# EasyEDA schematic SCH_Wordy-Watch-V1.1_2026-04-09.json
TITLE: Wordy Watch; REV: 1.1; Date: 2025-10-31; Sheet: 1/1; Drawn By: robdobsn; Company: Rob Dobson
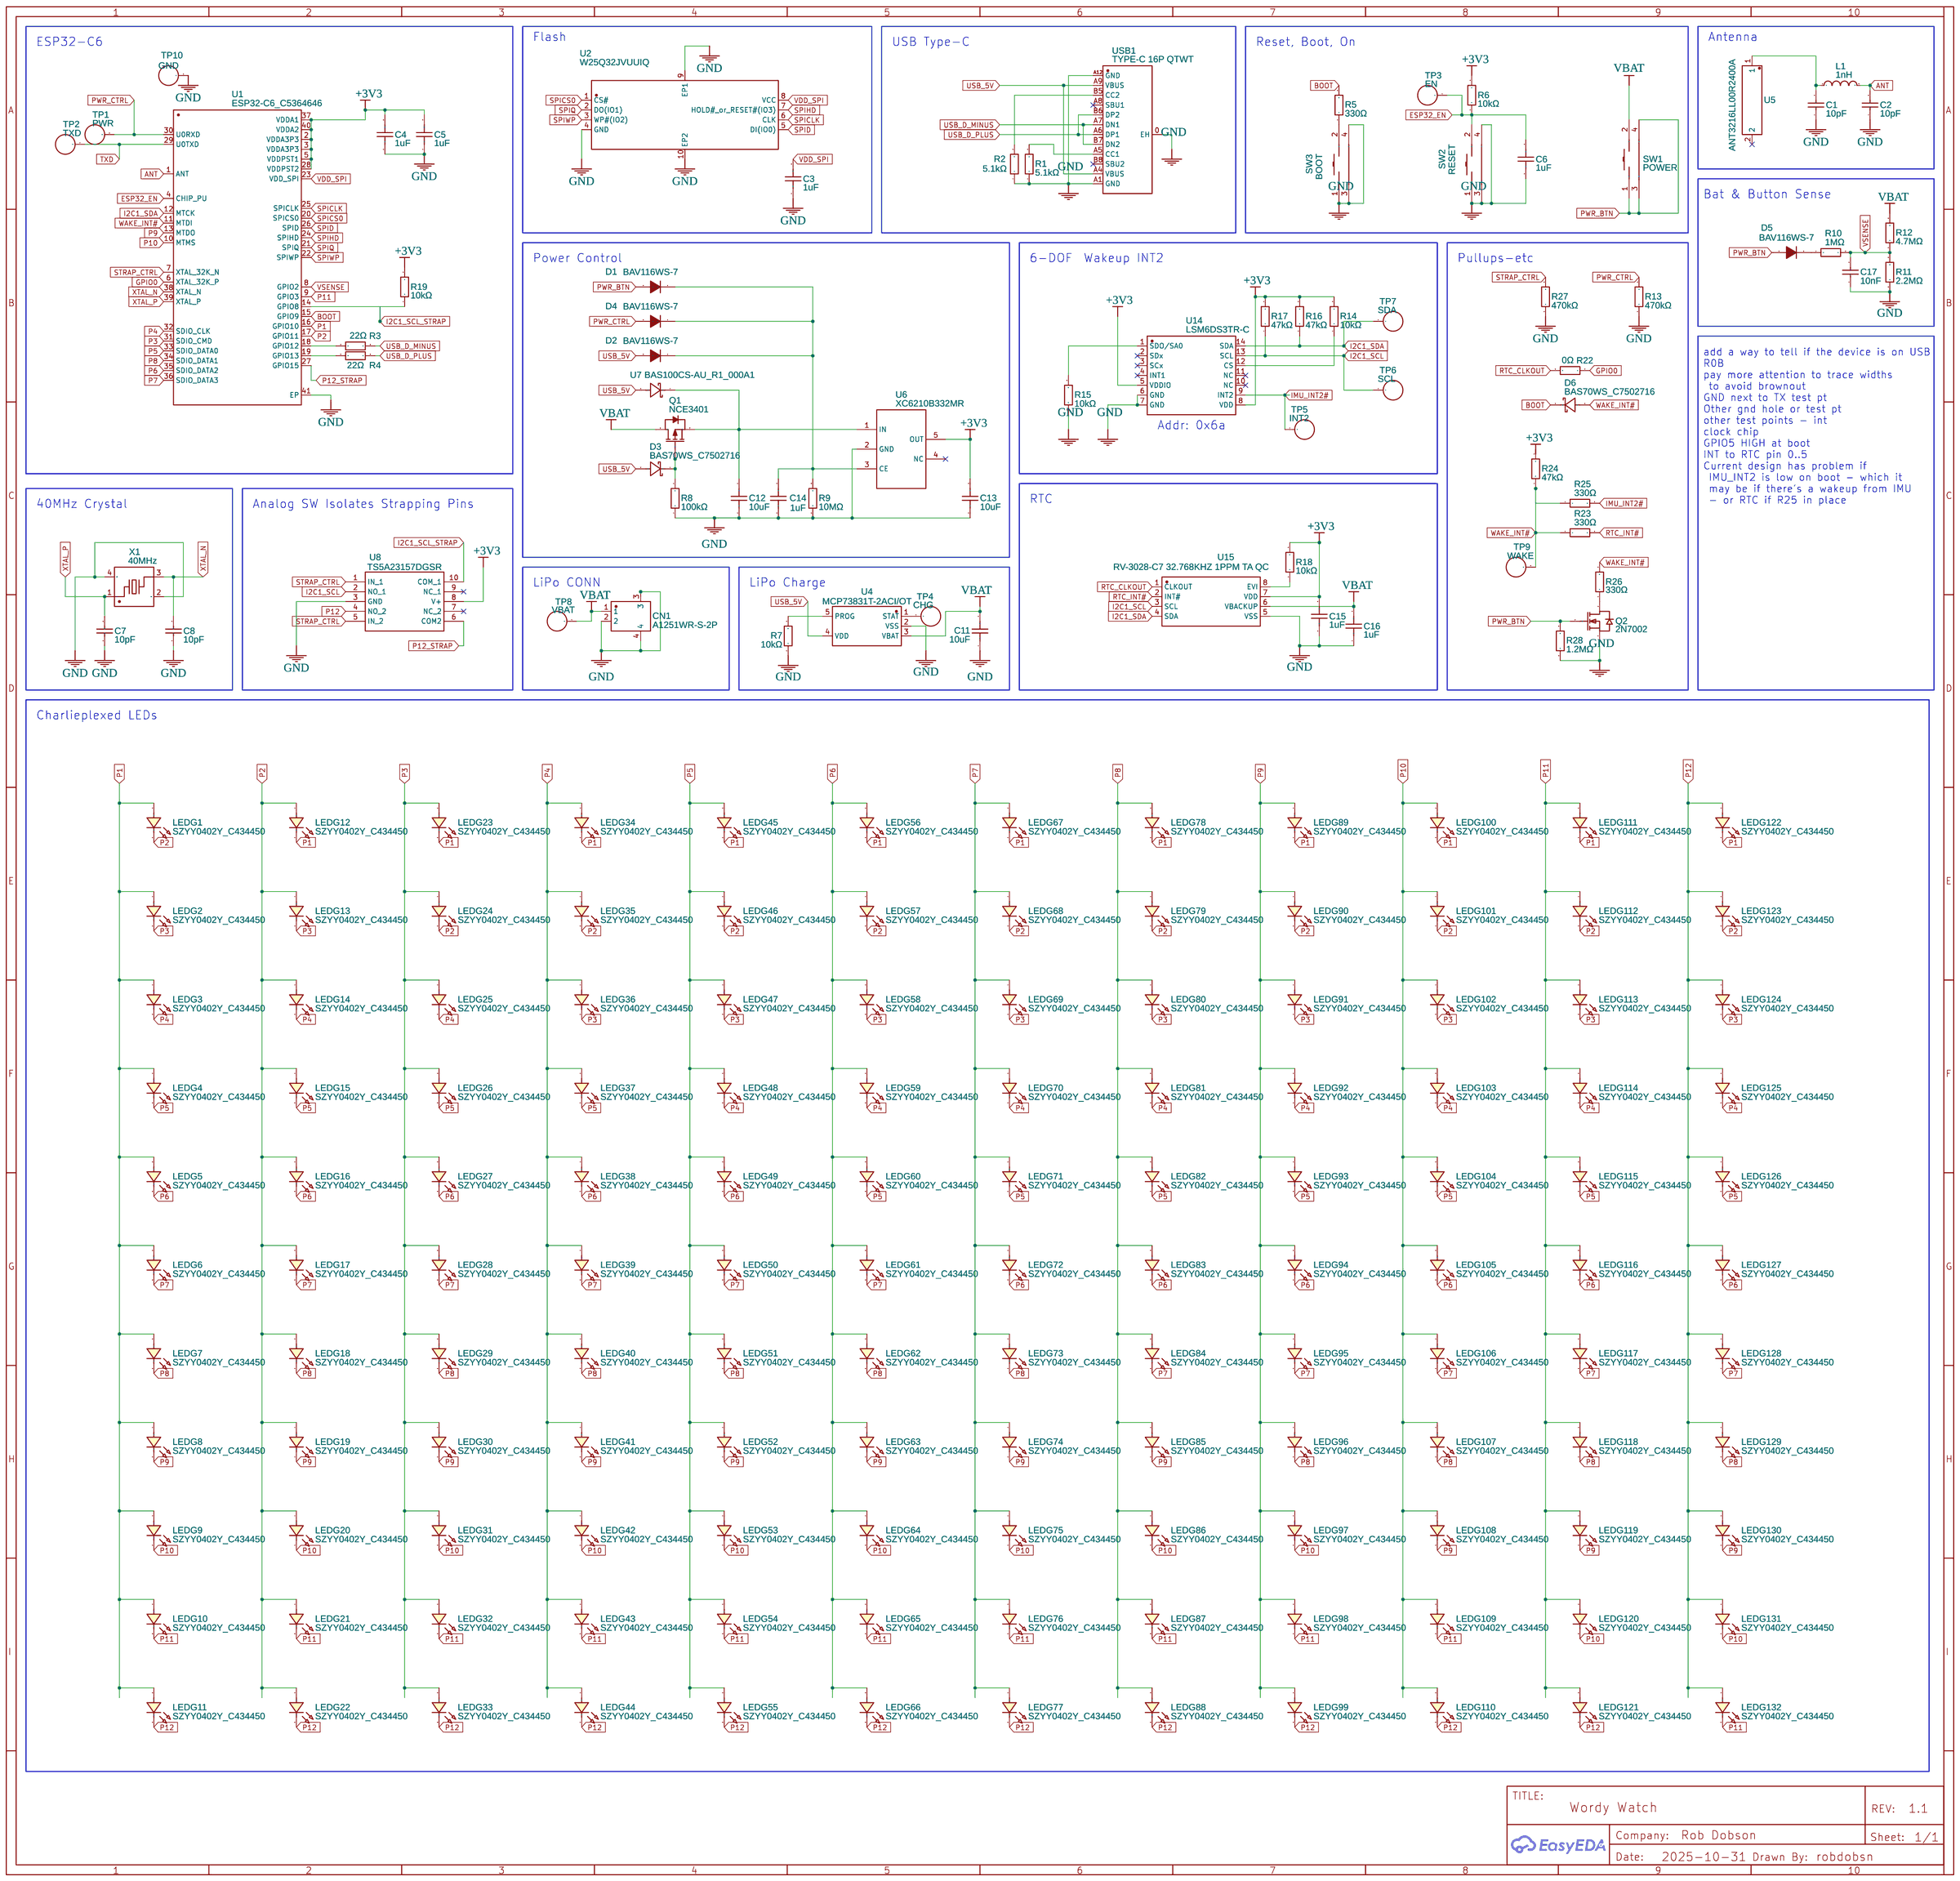
[diagram p0: schematic sheet]

## Parts
C1  10pF  [C0603]
C2  10pF  [C0603]
C3  1uF  [C0603]
C4  1uF  [C0603]
C5  1uF  [C0603]
C6  1uF  [C0603]
C7  10pF  [C0603]
C8  10pF  [C0603]
C11  10uF  [C0603]
C12  10uF  [C0603]
C13  10uF  [C0603]
C14  1uF  [C0603]
C15  1uF  [C0603]
C16  1uF  [C0603]
C17  10nF  [C0603]
CN1  A1251WR-S-2P  [CONN-SMD_A1251WR-S-2P]
D1  BAV116WS-7  [SOD-323_L1.8-W1.3-LS2.5-RD]
D2  BAV116WS-7  [SOD-323_L1.8-W1.3-LS2.5-RD]
D3  BAS70WS_C7502716  [SOD-323_L1.7-W1.3-LS2.6-RD-1]
D4  BAV116WS-7  [SOD-323_L1.8-W1.3-LS2.5-RD]
D5  BAV116WS-7  [SOD-323_L1.8-W1.3-LS2.5-RD]
D6  BAS70WS_C7502716  [SOD-323_L1.7-W1.3-LS2.6-RD-1]
L1  1nH  [L0402]
LEDG1  SZYY0402Y_C434450  [LED0402-FD_YELLOW]
LEDG2  SZYY0402Y_C434450  [LED0402-FD_YELLOW]
LEDG3  SZYY0402Y_C434450  [LED0402-FD_YELLOW]
LEDG4  SZYY0402Y_C434450  [LED0402-FD_YELLOW]
LEDG5  SZYY0402Y_C434450  [LED0402-FD_YELLOW]
LEDG6  SZYY0402Y_C434450  [LED0402-FD_YELLOW]
LEDG7  SZYY0402Y_C434450  [LED0402-FD_YELLOW]
LEDG8  SZYY0402Y_C434450  [LED0402-FD_YELLOW]
LEDG9  SZYY0402Y_C434450  [LED0402-FD_YELLOW]
LEDG10  SZYY0402Y_C434450  [LED0402-FD_YELLOW]
LEDG11  SZYY0402Y_C434450  [LED0402-FD_YELLOW]
LEDG12  SZYY0402Y_C434450  [LED0402-FD_YELLOW]
LEDG13  SZYY0402Y_C434450  [LED0402-FD_YELLOW]
LEDG14  SZYY0402Y_C434450  [LED0402-FD_YELLOW]
LEDG15  SZYY0402Y_C434450  [LED0402-FD_YELLOW]
LEDG16  SZYY0402Y_C434450  [LED0402-FD_YELLOW]
LEDG17  SZYY0402Y_C434450  [LED0402-FD_YELLOW]
LEDG18  SZYY0402Y_C434450  [LED0402-FD_YELLOW]
LEDG19  SZYY0402Y_C434450  [LED0402-FD_YELLOW]
LEDG20  SZYY0402Y_C434450  [LED0402-FD_YELLOW]
LEDG21  SZYY0402Y_C434450  [LED0402-FD_YELLOW]
LEDG22  SZYY0402Y_C434450  [LED0402-FD_YELLOW]
LEDG23  SZYY0402Y_C434450  [LED0402-FD_YELLOW]
LEDG24  SZYY0402Y_C434450  [LED0402-FD_YELLOW]
LEDG25  SZYY0402Y_C434450  [LED0402-FD_YELLOW]
LEDG26  SZYY0402Y_C434450  [LED0402-FD_YELLOW]
LEDG27  SZYY0402Y_C434450  [LED0402-FD_YELLOW]
LEDG28  SZYY0402Y_C434450  [LED0402-FD_YELLOW]
LEDG29  SZYY0402Y_C434450  [LED0402-FD_YELLOW]
LEDG30  SZYY0402Y_C434450  [LED0402-FD_YELLOW]
LEDG31  SZYY0402Y_C434450  [LED0402-FD_YELLOW]
LEDG32  SZYY0402Y_C434450  [LED0402-FD_YELLOW]
LEDG33  SZYY0402Y_C434450  [LED0402-FD_YELLOW]
LEDG34  SZYY0402Y_C434450  [LED0402-FD_YELLOW]
LEDG35  SZYY0402Y_C434450  [LED0402-FD_YELLOW]
LEDG36  SZYY0402Y_C434450  [LED0402-FD_YELLOW]
LEDG37  SZYY0402Y_C434450  [LED0402-FD_YELLOW]
LEDG38  SZYY0402Y_C434450  [LED0402-FD_YELLOW]
LEDG39  SZYY0402Y_C434450  [LED0402-FD_YELLOW]
LEDG40  SZYY0402Y_C434450  [LED0402-FD_YELLOW]
LEDG41  SZYY0402Y_C434450  [LED0402-FD_YELLOW]
LEDG42  SZYY0402Y_C434450  [LED0402-FD_YELLOW]
LEDG43  SZYY0402Y_C434450  [LED0402-FD_YELLOW]
LEDG44  SZYY0402Y_C434450  [LED0402-FD_YELLOW]
LEDG45  SZYY0402Y_C434450  [LED0402-FD_YELLOW]
LEDG46  SZYY0402Y_C434450  [LED0402-FD_YELLOW]
LEDG47  SZYY0402Y_C434450  [LED0402-FD_YELLOW]
LEDG48  SZYY0402Y_C434450  [LED0402-FD_YELLOW]
LEDG49  SZYY0402Y_C434450  [LED0402-FD_YELLOW]
LEDG50  SZYY0402Y_C434450  [LED0402-FD_YELLOW]
LEDG51  SZYY0402Y_C434450  [LED0402-FD_YELLOW]
LEDG52  SZYY0402Y_C434450  [LED0402-FD_YELLOW]
LEDG53  SZYY0402Y_C434450  [LED0402-FD_YELLOW]
LEDG54  SZYY0402Y_C434450  [LED0402-FD_YELLOW]
LEDG55  SZYY0402Y_C434450  [LED0402-FD_YELLOW]
LEDG56  SZYY0402Y_C434450  [LED0402-FD_YELLOW]
LEDG57  SZYY0402Y_C434450  [LED0402-FD_YELLOW]
LEDG58  SZYY0402Y_C434450  [LED0402-FD_YELLOW]
LEDG59  SZYY0402Y_C434450  [LED0402-FD_YELLOW]
LEDG60  SZYY0402Y_C434450  [LED0402-FD_YELLOW]
LEDG61  SZYY0402Y_C434450  [LED0402-FD_YELLOW]
LEDG62  SZYY0402Y_C434450  [LED0402-FD_YELLOW]
LEDG63  SZYY0402Y_C434450  [LED0402-FD_YELLOW]
LEDG64  SZYY0402Y_C434450  [LED0402-FD_YELLOW]
LEDG65  SZYY0402Y_C434450  [LED0402-FD_YELLOW]
LEDG66  SZYY0402Y_C434450  [LED0402-FD_YELLOW]
LEDG67  SZYY0402Y_C434450  [LED0402-FD_YELLOW]
LEDG68  SZYY0402Y_C434450  [LED0402-FD_YELLOW]
LEDG69  SZYY0402Y_C434450  [LED0402-FD_YELLOW]
LEDG70  SZYY0402Y_C434450  [LED0402-FD_YELLOW]
LEDG71  SZYY0402Y_C434450  [LED0402-FD_YELLOW]
LEDG72  SZYY0402Y_C434450  [LED0402-FD_YELLOW]
LEDG73  SZYY0402Y_C434450  [LED0402-FD_YELLOW]
LEDG74  SZYY0402Y_C434450  [LED0402-FD_YELLOW]
LEDG75  SZYY0402Y_C434450  [LED0402-FD_YELLOW]
LEDG76  SZYY0402Y_C434450  [LED0402-FD_YELLOW]
LEDG77  SZYY0402Y_C434450  [LED0402-FD_YELLOW]
LEDG78  SZYY0402Y_C434450  [LED0402-FD_YELLOW]
LEDG79  SZYY0402Y_C434450  [LED0402-FD_YELLOW]
LEDG80  SZYY0402Y_C434450  [LED0402-FD_YELLOW]
LEDG81  SZYY0402Y_C434450  [LED0402-FD_YELLOW]
LEDG82  SZYY0402Y_C434450  [LED0402-FD_YELLOW]
LEDG83  SZYY0402Y_C434450  [LED0402-FD_YELLOW]
LEDG84  SZYY0402Y_C434450  [LED0402-FD_YELLOW]
LEDG85  SZYY0402Y_C434450  [LED0402-FD_YELLOW]
LEDG86  SZYY0402Y_C434450  [LED0402-FD_YELLOW]
LEDG87  SZYY0402Y_C434450  [LED0402-FD_YELLOW]
LEDG88  SZYY0402Y_C434450  [LED0402-FD_YELLOW]
LEDG89  SZYY0402Y_C434450  [LED0402-FD_YELLOW]
LEDG90  SZYY0402Y_C434450  [LED0402-FD_YELLOW]
LEDG91  SZYY0402Y_C434450  [LED0402-FD_YELLOW]
LEDG92  SZYY0402Y_C434450  [LED0402-FD_YELLOW]
LEDG93  SZYY0402Y_C434450  [LED0402-FD_YELLOW]
LEDG94  SZYY0402Y_C434450  [LED0402-FD_YELLOW]
LEDG95  SZYY0402Y_C434450  [LED0402-FD_YELLOW]
LEDG96  SZYY0402Y_C434450  [LED0402-FD_YELLOW]
LEDG97  SZYY0402Y_C434450  [LED0402-FD_YELLOW]
LEDG98  SZYY0402Y_C434450  [LED0402-FD_YELLOW]
LEDG99  SZYY0402Y_C434450  [LED0402-FD_YELLOW]
LEDG100  SZYY0402Y_C434450  [LED0402-FD_YELLOW]
LEDG101  SZYY0402Y_C434450  [LED0402-FD_YELLOW]
LEDG102  SZYY0402Y_C434450  [LED0402-FD_YELLOW]
LEDG103  SZYY0402Y_C434450  [LED0402-FD_YELLOW]
LEDG104  SZYY0402Y_C434450  [LED0402-FD_YELLOW]
LEDG105  SZYY0402Y_C434450  [LED0402-FD_YELLOW]
LEDG106  SZYY0402Y_C434450  [LED0402-FD_YELLOW]
LEDG107  SZYY0402Y_C434450  [LED0402-FD_YELLOW]
LEDG108  SZYY0402Y_C434450  [LED0402-FD_YELLOW]
LEDG109  SZYY0402Y_C434450  [LED0402-FD_YELLOW]
LEDG110  SZYY0402Y_C434450  [LED0402-FD_YELLOW]
LEDG111  SZYY0402Y_C434450  [LED0402-FD_YELLOW]
LEDG112  SZYY0402Y_C434450  [LED0402-FD_YELLOW]
LEDG113  SZYY0402Y_C434450  [LED0402-FD_YELLOW]
LEDG114  SZYY0402Y_C434450  [LED0402-FD_YELLOW]
LEDG115  SZYY0402Y_C434450  [LED0402-FD_YELLOW]
LEDG116  SZYY0402Y_C434450  [LED0402-FD_YELLOW]
LEDG117  SZYY0402Y_C434450  [LED0402-FD_YELLOW]
LEDG118  SZYY0402Y_C434450  [LED0402-FD_YELLOW]
LEDG119  SZYY0402Y_C434450  [LED0402-FD_YELLOW]
LEDG120  SZYY0402Y_C434450  [LED0402-FD_YELLOW]
LEDG121  SZYY0402Y_C434450  [LED0402-FD_YELLOW]
LEDG122  SZYY0402Y_C434450  [LED0402-FD_YELLOW]
LEDG123  SZYY0402Y_C434450  [LED0402-FD_YELLOW]
LEDG124  SZYY0402Y_C434450  [LED0402-FD_YELLOW]
LEDG125  SZYY0402Y_C434450  [LED0402-FD_YELLOW]
LEDG126  SZYY0402Y_C434450  [LED0402-FD_YELLOW]
LEDG127  SZYY0402Y_C434450  [LED0402-FD_YELLOW]
LEDG128  SZYY0402Y_C434450  [LED0402-FD_YELLOW]
LEDG129  SZYY0402Y_C434450  [LED0402-FD_YELLOW]
LEDG130  SZYY0402Y_C434450  [LED0402-FD_YELLOW]
LEDG131  SZYY0402Y_C434450  [LED0402-FD_YELLOW]
LEDG132  SZYY0402Y_C434450  [LED0402-FD_YELLOW]
Q1  NCE3401  [SOT-23-3_L2.9-W1.6-P1.90-LS2.8-BR]
Q2  2N7002  [SOT-23-3_L2.9-W1.3-P1.90-LS2.4-BR]
R1  5.1kΩ  [R0603]
R2  5.1kΩ  [R0603]
R3  22Ω  [R0603]
R4  22Ω  [R0603]
R5  330Ω  [R0603]
R6  10kΩ  [R0603]
R7  10kΩ  [R0603]
R8  100kΩ  [R0603]
R9  10MΩ  [R0603]
R10  1MΩ  [R0603]
R11  2.2MΩ  [R0603]
R12  4.7MΩ  [R0603]
R13  470kΩ  [R0603]
R14  10kΩ  [R0603]
R15  10kΩ  [R0603]
R16  47kΩ  [R0603]
R17  47kΩ  [R0603]
R18  10kΩ  [R0603]
R19  10kΩ  [R0603]
R22  0Ω  [R0603]
R23  330Ω  [R0603]
R24  47kΩ  [R0603]
R25  330Ω  [R0603]
R26  330Ω  [R0603]
R27  470kΩ  [R0603]
R28  1.2MΩ  [R0603]
SW1  POWER  [KEY-SMD_K2-1806SA-AXXW-XX]
SW2  RESET  [KEY-SMD_K2-1806SA-AXXW-XX]
SW3  BOOT  [KEY-SMD_K2-1806SA-AXXW-XX]
TP1  PWR  [TESTPAD0]
TP2  TXD  [TESTPAD0]
TP3  EN  [TESTPAD0]
TP4  CHG  [TESTPAD0]
TP5  INT2  [TESTPAD0]
TP6  SCL  [TESTPAD0]
TP7  SDA  [TESTPAD0]
TP8  VBAT  [TESTPAD0]
TP9  WAKE  [TESTPAD0]
TP10  GND  [TESTPAD0]
U1  ESP32-C6_C5364646  [QFN-40_L5.0-W5.0-P0.40-TL-EP3.3]
U2  W25Q32JVUUIQ  [USON-8_L4.0-W3.0-P0.80-BL_WINBOND_UU]
U4  MCP73831T-2ACI/OT  [SOT-23-5_L3.0-W1.7-P0.95-LS2.8-BL]
U5  ANT3216LL00R2400A  [ANT-SMD_L3.2-W1.6]
U6  XC6210B332MR  [SOT-23-5_L3.0-W1.7-P0.95-LS2.8-BR]
U7  BAS100CS-AU_R1_000A1  [SOD-323_L1.8-W1.3-LS2.5-RD-1]
U8  TS5A23157DGSR  [MSOP-10_L3.0-W3.0-P0.50-LS5.0-BL]
U14  LSM6DS3TR-C  [LGA-14_L3.0-W2.5-P0.50-TL]
U15  RV-3028-C7 32.768KHZ 1PPM TA QC  [OSC-SMD_8P-L3.2-W1.5-P0.90-BL]
USB1  TYPE-C 16P QTWT  [USB-TYPE-C-SMD_TYPE-C-16P-QTWT]
X1  40MHz  [CRYSTAL-SMD_4P-L1.6-W1.2-BL]

## Library data of the parts
C1 C2 C7 C8 = CL10C100JB8NNNC: Supplier: LCSC; Manufacturer: SAMSUNG(三星); Supplier Part: C1634; JLCPCB Part Class: Basic Part
C3-C6 C14-C16 = CL10A105KB8NNNC: Supplier: LCSC; Manufacturer: SAMSUNG(三星); Supplier Part: C15849; JLCPCB Part Class: Basic Part
C11 = CL10A106MA8NRNC: Supplier: LCSC; Manufacturer: SAMSUNG(三星); Supplier Part: C96446; JLCPCB Part Class: Basic Part; link: https://lcsc.com/eda_search?q=C96446&%26type=1&ref=editor
C12 C13 = CL10A106MA8NRNC: Supplier: LCSC; Manufacturer: SAMSUNG(三星); Supplier Part: C96446; JLCPCB Part Class: Basic Part
C17 = 0603B103K500NT: Supplier: LCSC; Manufacturer: FH(风华); Supplier Part: C57112; JLCPCB Part Class: Basic Part
CN1 = A1251WR-S-2P: Contributor: LCSC; JLCPCB Part Class: Extended Part; Supplier: LCSC; Supplier Part: C225111; Manufacturer: CJT(长江连接器)
D1 D2 D4 D5 = BAV116WS-7: Contributor: LCSC; Supplier: LCSC; Supplier Part: C459842; Manufacturer: DIODES(美台); JLCPCB Part Class: Extended Part
D3 D6 = BAS70WS_C7502716: Supplier: LCSC; Supplier Part: C7502716; Manufacturer: R+O(宏嘉诚); Manufacturer Part: BAS70WS; Contributor: lcsc; JLCPCB Part Class: Extended Part
L1 = LQG15HS1N0S02D: Supplier: LCSC; Manufacturer: muRata(村田); Supplier Part: C18222; JLCPCB Part Class: Extended Part
LEDG1-LEDG132 = SZYY0402Y_C434450: Contributor: lcsc; Supplier: LCSC; Supplier Part: C434450; Manufacturer: yongyu(永裕光电); Manufacturer Part: SZYY0402Y; JLCPCB Part Class: Extended Part
Q1 = NCE3401: Supplier: LCSC; Manufacturer: NCE(无锡新洁能); Supplier Part: C113490; JLCPCB Part Class: Extended Part
Q2 = 2N7002: Supplier: LCSC; Manufacturer: CJ(江苏长电/长晶); Supplier Part: C8545; JLCPCB Part Class: Basic Part
R1 R2 = 0603WAF5101T5E: Supplier: LCSC; Manufacturer: UNI-ROYAL(厚声); Supplier Part: C23186; Resistance (Ohms): 5.1K; JLCPCB Part Class: Basic Part
R3 R4 = 0603WAF220JT5E: Supplier: LCSC; Manufacturer: UNI-ROYAL(厚声); Supplier Part: C23345; JLCPCB Part Class: Basic Part
R5 R23 R25 R26 = 0603WAF3300T5E: Supplier: LCSC; Manufacturer: UNI-ROYAL(厚声); Supplier Part: C23138; JLCPCB Part Class: Basic Part
R6 R18 R19 = 0603WAF1002T5E: Supplier: LCSC; Manufacturer: UNI-ROYAL(厚声); Supplier Part: C25804; JLCPCB Part Class: Basic Part
R7 R14 R15 = 0603WAF1002T5E: Supplier: LCSC; Manufacturer: UNI-ROYAL(厚声); Supplier Part: C25804; JLCPCB Part Class: Basic Part; link: https://lcsc.com/eda_search?q=C25804&%26type=1&ref=editor
R8 = 0603WAF1003T5E: Supplier: LCSC; Manufacturer: UNI-ROYAL(厚声); Supplier Part: C25803; JLCPCB Part Class: Basic Part
R9 = RC0603FR-0710ML: Supplier: LCSC; Manufacturer: YAGEO(国巨); Supplier Part: C114606; JLCPCB Part Class: Extended Part
R10 = 0603WAF1004T5E: Supplier: LCSC; Manufacturer: UNI-ROYAL(厚声); Supplier Part: C22935; JLCPCB Part Class: Basic Part
R11 = 0603WAF2204T5E: Supplier: LCSC; Manufacturer: UNI-ROYAL(厚声); Supplier Part: C22938; JLCPCB Part Class: Extended Part
R12 = 0603WAF4704T5E: Supplier: LCSC; Manufacturer: UNI-ROYAL(厚声); Supplier Part: C23163; JLCPCB Part Class: Extended Part
R13 R27 = 0603WAF4703T5E: Supplier: LCSC; Manufacturer: UNI-ROYAL(厚声); Supplier Part: C23178; JLCPCB Part Class: Basic Part
R16 R17 R24 = 0603WAF4702T5E: Supplier: LCSC; Manufacturer: UNI-ROYAL(厚声); Supplier Part: C25819; JLCPCB Part Class: Basic Part
R22 = 0603WAF0000T5E: Supplier: LCSC; Manufacturer: UNI-ROYAL(厚声); Supplier Part: C21189; JLCPCB Part Class: Basic Part
R28 = 0603WAF1204T5E_C13315: Supplier: LCSC; Manufacturer: UNI-ROYAL(厚声); Manufacturer Part: 0603WAF1204T5E; Supplier Part: C13315; JLCPCB Part Class: Extended Part
SW1-SW3 = K2-1806SA-C4DW-04: Contributor: LCSC; Supplier: LCSC; Supplier Part: C961746; Manufacturer: 韩国韩荣; JLCPCB Part Class: Extended Part
TP1-TP10 = TEST_PAD: Manufacturer Part: TESTPAD; Contributor: wenjuntijee
U1 = ESP32-C6_C5364646: Supplier: LCSC; Supplier Part: C5364646; Manufacturer: ESPRESSIF(乐鑫); Manufacturer Part: ESP32-C6; JLCPCB Part Class: Extended Part; Contributor: lcsc
U2 = W25Q32JVUUIQ: Contributor: lcsc; Supplier: LCSC; Supplier Part: C2999380; Manufacturer: Winbond(华邦); JLCPCB Part Class: Extended Part
U4 = MCP73831T-2ACI/OT: Contributor: LCSC; Supplier: LCSC; Supplier Part: C424093; Manufacturer: MICROCHIP(美国微芯); JLCPCB Part Class: Extended Part; link: https://lcsc.com/eda_search?q=C424093&%26type=1&ref=editor
U5 = ANT3216LL00R2400A: Contributor: LCSC; Supplier: LCSC; Supplier Part: C293767; Manufacturer: YAGEO(国巨); JLCPCB Part Class: Extended Part; link: https://lcsc.com/eda_search?q=C293767&%26type=1&ref=editor
U6 = XC6210B332MR: Supplier: LCSC; Manufacturer: TOREX(特瑞仕); Manufacturer Part: XC6210B332MR-G; Supplier Part: C47719; JLCPCB Part Class: Extended Part
U7 = BAS100CS-AU_R1_000A1: Supplier: LCSC; Supplier Part: C2999088; Manufacturer: PANJIT(强茂); Contributor: lcsc; JLCPCB Part Class: Extended Part
U8 = TS5A23157DGSR: Supplier: LCSC; Manufacturer: TI(德州仪器); Supplier Part: C11133; JLCPCB Part Class: Extended Part
U14 = LSM6DS3TR-C: Contributor: LCSC; Supplier: LCSC; Supplier Part: C967633; Manufacturer: ST(意法半导体); JLCPCB Part Class: Extended Part
U15 = RV-3028-C7 32.768KHZ 1PPM TA QC: Contributor: lcsc; Supplier: LCSC; Supplier Part: C3019759; Manufacturer: Micro Crystal(瑞士微晶); Manufacturer Part: RV-3028-C7-32.768kHz-1ppm-TA-QC; JLCPCB Part Class: Extended Part
USB1 = TYPE-C 16P QTWT: Contributor: lcsc; Supplier: LCSC; Supplier Part: C5187472; Manufacturer: SHOU HAN(首韩); JLCPCB Part Class: Extended Part
X1 = CJ17-400001010B20: Contributor: lcsc; Supplier: LCSC; Supplier Part: C2875272; Manufacturer: CJ(江苏长电/长晶); JLCPCB Part Class: Extended Part

## Nets
+3V3: C4.2 C5.2 C13.2 C15.2 R6.2 R14.2 R16.2 R17.2 R18.2 R19.2 R24.2 U1.2(VDDA3P3) U1.3(VDDA3P3) U1.5(VDDPST1) U1.28(VDDPST2) U1.37(VDDA1) U1.40(VDDA2) U6.5(OUT) U8.8(V+) U14.5(VDDIO) U14.8(VDD) U15.7(VDD)
GND: C1.1 C2.1 C3.1 C4.1 C5.1 C6.1 C7.1 C8.1 C11.1 C12.1 C13.1 C14.1 C15.1 C16.1 C17.1 CN1.2 CN1.3 CN1.4 Q2.2(S) R1.1 R2.1 R7.1 R8.1 R9.1 R11.1 R13.1 R15.1 R27.1 R28.1 SW2.1 SW2.3 SW2.4 SW3.1 SW3.3 SW3.4 TP10.1 U1.41(EP) U2.4(GND) U2.9(EP1) U2.10(EP2) U4.2(VSS) U6.2(GND) U8.3(GND) U14.6(GND) U14.7(GND) U15.5(VSS) USB1.0(EH) USB1.A1(GND) USB1.A12(GND) X1.2(GND) X1.4(GND)
VBAT: C11.2 C16.2 CN1.1 Q1.3(D) R12.2 SW1.2 TP8.1 U4.3(VBAT) U15.6(VBACKUP)
VDD_SPI: C3.2 U1.23(VDD_SPI) U2.8(VCC)
ANT: C2.2 L1.2 U1.1(ANT)
BOOT: D6.1(K) R5.2 U1.15(GPIO9)
ESP32_EN: C6.2 R6.1 SW2.2 TP3.1 U1.4(CHIP_PU)
GPIO0: R22.1 U1.6(XTAL_32K_P)
I2C1_SCL: R17.1 TP6.1 U8.2(NO 1) U14.13(SCL) U15.3(SCL)
I2C1_SCL_STRAP: R19.1 U1.14(GPIO8) U8.10(COM 1)
I2C1_SDA: R16.1 TP7.1 U1.12(MTCK) U14.14(SDA) U15.4(SDA)
IMU_INT2#: R25.2 TP5.1 U14.9(INT2)
P1: LEDG1.1(A) LEDG2.1(A) LEDG3.1(A) LEDG4.1(A) LEDG5.1(A) LEDG6.1(A) LEDG7.1(A) LEDG8.1(A) LEDG9.1(A) LEDG10.1(A) LEDG11.1(A) LEDG12.2(K) LEDG23.2(K) LEDG34.2(K) LEDG45.2(K) LEDG56.2(K) LEDG67.2(K) LEDG78.2(K) LEDG89.2(K) LEDG100.2(K) LEDG111.2(K) LEDG122.2(K) U1.16(GPIO10)
P2: LEDG1.2(K) LEDG12.1(A) LEDG13.1(A) LEDG14.1(A) LEDG15.1(A) LEDG16.1(A) LEDG17.1(A) LEDG18.1(A) LEDG19.1(A) LEDG20.1(A) LEDG21.1(A) LEDG22.1(A) LEDG24.2(K) LEDG35.2(K) LEDG46.2(K) LEDG57.2(K) LEDG68.2(K) LEDG79.2(K) LEDG90.2(K) LEDG101.2(K) LEDG112.2(K) LEDG123.2(K) U1.17(GPIO11)
P3: LEDG2.2(K) LEDG13.2(K) LEDG23.1(A) LEDG24.1(A) LEDG25.1(A) LEDG26.1(A) LEDG27.1(A) LEDG28.1(A) LEDG29.1(A) LEDG30.1(A) LEDG31.1(A) LEDG32.1(A) LEDG33.1(A) LEDG36.2(K) LEDG47.2(K) LEDG58.2(K) LEDG69.2(K) LEDG80.2(K) LEDG91.2(K) LEDG102.2(K) LEDG113.2(K) LEDG124.2(K) U1.31(SDIO_CMD)
P4: LEDG3.2(K) LEDG14.2(K) LEDG25.2(K) LEDG34.1(A) LEDG35.1(A) LEDG36.1(A) LEDG37.1(A) LEDG38.1(A) LEDG39.1(A) LEDG40.1(A) LEDG41.1(A) LEDG42.1(A) LEDG43.1(A) LEDG44.1(A) LEDG48.2(K) LEDG59.2(K) LEDG70.2(K) LEDG81.2(K) LEDG92.2(K) LEDG103.2(K) LEDG114.2(K) LEDG125.2(K) U1.32(SDIO_CLK)
P5: LEDG4.2(K) LEDG15.2(K) LEDG26.2(K) LEDG37.2(K) LEDG45.1(A) LEDG46.1(A) LEDG47.1(A) LEDG48.1(A) LEDG49.1(A) LEDG50.1(A) LEDG51.1(A) LEDG52.1(A) LEDG53.1(A) LEDG54.1(A) LEDG55.1(A) LEDG60.2(K) LEDG71.2(K) LEDG82.2(K) LEDG93.2(K) LEDG104.2(K) LEDG115.2(K) LEDG126.2(K) U1.33(SDIO_DATA0)
P6: LEDG5.2(K) LEDG16.2(K) LEDG27.2(K) LEDG38.2(K) LEDG49.2(K) LEDG56.1(A) LEDG57.1(A) LEDG58.1(A) LEDG59.1(A) LEDG60.1(A) LEDG61.1(A) LEDG62.1(A) LEDG63.1(A) LEDG64.1(A) LEDG65.1(A) LEDG66.1(A) LEDG72.2(K) LEDG83.2(K) LEDG94.2(K) LEDG105.2(K) LEDG116.2(K) LEDG127.2(K) U1.35(SDIO_DATA2)
P7: LEDG6.2(K) LEDG17.2(K) LEDG28.2(K) LEDG39.2(K) LEDG50.2(K) LEDG61.2(K) LEDG67.1(A) LEDG68.1(A) LEDG69.1(A) LEDG70.1(A) LEDG71.1(A) LEDG72.1(A) LEDG73.1(A) LEDG74.1(A) LEDG75.1(A) LEDG76.1(A) LEDG77.1(A) LEDG84.2(K) LEDG95.2(K) LEDG106.2(K) LEDG117.2(K) LEDG128.2(K) U1.36(SDIO_DATA3)
P8: LEDG7.2(K) LEDG18.2(K) LEDG29.2(K) LEDG40.2(K) LEDG51.2(K) LEDG62.2(K) LEDG73.2(K) LEDG78.1(A) LEDG79.1(A) LEDG80.1(A) LEDG81.1(A) LEDG82.1(A) LEDG83.1(A) LEDG84.1(A) LEDG85.1(A) LEDG86.1(A) LEDG87.1(A) LEDG88.1(A) LEDG96.2(K) LEDG107.2(K) LEDG118.2(K) LEDG129.2(K) U1.34(SDIO_DATA1)
P9: LEDG8.2(K) LEDG19.2(K) LEDG30.2(K) LEDG41.2(K) LEDG52.2(K) LEDG63.2(K) LEDG74.2(K) LEDG85.2(K) LEDG89.1(A) LEDG90.1(A) LEDG91.1(A) LEDG92.1(A) LEDG93.1(A) LEDG94.1(A) LEDG95.1(A) LEDG96.1(A) LEDG97.1(A) LEDG98.1(A) LEDG99.1(A) LEDG108.2(K) LEDG119.2(K) LEDG130.2(K) U1.13(MTDO)
P10: LEDG9.2(K) LEDG20.2(K) LEDG31.2(K) LEDG42.2(K) LEDG53.2(K) LEDG64.2(K) LEDG75.2(K) LEDG86.2(K) LEDG97.2(K) LEDG100.1(A) LEDG101.1(A) LEDG102.1(A) LEDG103.1(A) LEDG104.1(A) LEDG105.1(A) LEDG106.1(A) LEDG107.1(A) LEDG108.1(A) LEDG109.1(A) LEDG110.1(A) LEDG120.2(K) LEDG131.2(K) U1.10(MTMS)
P11: LEDG10.2(K) LEDG21.2(K) LEDG32.2(K) LEDG43.2(K) LEDG54.2(K) LEDG65.2(K) LEDG76.2(K) LEDG87.2(K) LEDG98.2(K) LEDG109.2(K) LEDG111.1(A) LEDG112.1(A) LEDG113.1(A) LEDG114.1(A) LEDG115.1(A) LEDG116.1(A) LEDG117.1(A) LEDG118.1(A) LEDG119.1(A) LEDG120.1(A) LEDG121.1(A) LEDG132.2(K) U1.9(GPIO3)
P12: LEDG11.2(K) LEDG22.2(K) LEDG33.2(K) LEDG44.2(K) LEDG55.2(K) LEDG66.2(K) LEDG77.2(K) LEDG88.2(K) LEDG99.2(K) LEDG110.2(K) LEDG121.2(K) LEDG122.1(A) LEDG123.1(A) LEDG124.1(A) LEDG125.1(A) LEDG126.1(A) LEDG127.1(A) LEDG128.1(A) LEDG129.1(A) LEDG130.1(A) LEDG131.1(A) LEDG132.1(A) U8.4(NO 2)
P12_STRAP: U1.27(GPIO15) U8.6(COM2)
PWR_BTN: D1.2(A) D5.2(A) Q2.1(G) R28.2 SW1.1 SW1.3 SW1.4
PWR_CTRL: D4.2(A) R13.2 TP1.1 U1.30(U0RXD)
RTC_CLKOUT: R22.2 U15.1(CLKOUT)
RTC_INT#: R23.2 U15.2(INT#)
SPICLK: U1.25(SPICLK) U2.6(CLK)
SPICS0: U1.20(SPICS0) U2.1(CS#)
SPID: U1.26(SPID) U2.5(DI(IO0))
SPIHD: U1.24(SPIHD) U2.7(HOLD# or RESET#(IO3))
SPIQ: U1.21(SPIQ) U2.2(DO(IO1))
SPIWP: U1.22(SPIWP) U2.3(WP#(IO2))
STRAP_CTRL: R27.2 U1.7(XTAL_32K_N) U8.1(IN 1) U8.5(IN 2)
TXD: TP2.1 U1.29(U0TXD)
USB_5V: D2.2(A) D3.2(A) U4.4(VDD) U7.2(A) USB1.A4(VBUS) USB1.A9(VBUS)
USB_D_MINUS: R3.2 USB1.A7(DN1) USB1.B7(DN2)
USB_D_PLUS: R4.2 USB1.A6(DP1) USB1.B6(DP2)
VSENSE: C17.2 R10.2 R11.2 R12.1 U1.8(GPIO2)
WAKE_INT#: D6.2(A) R23.1 R24.1 R25.1 R26.2 TP9.1 U1.11(MTDI)
XTAL_N: C8.2 U1.38(XTAL_N) X1.3
XTAL_P: C7.2 U1.39(XTAL_P) X1.1
Net-(C1-2): C1.2 L1.1 U5.1
Net-(C12-2): C12.2 Q1.2(S) U6.1(IN) U7.1(C)
Net-(C14-2): C14.2 D1.1(K) D2.1(K) D4.1(K) R9.2 U6.3(CE)
Net-(D3-1): D3.1(K) Q1.1(G) R8.2
Net-(D5-1): D5.1(K) R10.1
Net-(Q2-3): Q2.3(D) R26.1
Net-(R1-2): R1.2 USB1.A5(CC1)
Net-(R2-2): R2.2 USB1.B5(CC2)
Net-(R3-1): R3.1 U1.18(GPIO12)
Net-(R4-1): R4.1 U1.19(GPIO13)
Net-(R5-1): R5.1 SW3.2
Net-(R7-2): R7.2 U4.5(PROG)
Net-(R14-1): R14.1 U14.12(CS)
Net-(R15-2): R15.2 U14.1(SDO/SA0)
Net-(R18-1): R18.1 U15.8(EVI)
Net-(TP4-1): TP4.1 U4.1(STAT)

Not connected (* = marked no-connect by the designer): U5 2*; U6 4(NC)*; U8 7(NC 2)* 9(NC 1)*; U14 2(SDx)* 3(SCx)* 4(INT1)* 10(NC)* 11(NC)*; USB1 A8(SBU1)* B8(SBU2)*

## Notes on the sheet
- Flash
- Antenna
- ESP32-C6
- USB Type-C
- Reset, Boot, On
- Bat & Button Sense
- Power Control
- 6-DOF
- Wakeup INT2
- Pullups-etc
- add a way to tell if the device is on USB
  R0B
  pay more attention to trace widths
   to avoid brownout
  GND next to TX test pt
  Other gnd hole or test pt
  other test points - int
  clock chip
  GPIO5 HIGH at boot
  INT to RTC pin 0..5
  Current design has problem if
   IMU_INT2 is low on boot - which it
   may be if there's a wakeup from IMU
   - or RTC if R25 in place
- Addr: 0x6a
- 40MHz Crystal
- Analog SW Isolates Strapping Pins
- RTC
- LiPo CONN
- LiPo Charge
- Charlieplexed LEDs
